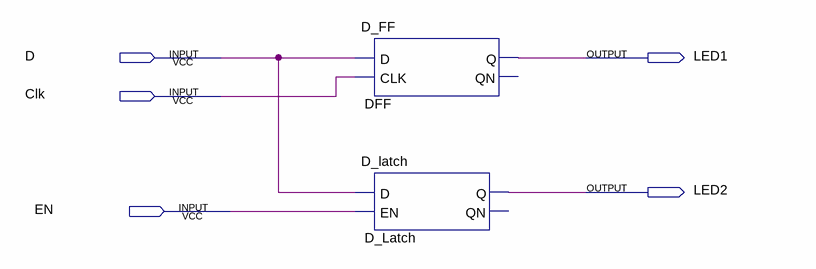
[diagram p0: schematic sheet]
// Quartus schematic D.bdf as structural Verilog: 2 symbols, 5 pins
module D (
  input  D,
  input  Clk,
  input  EN,
  output LED1,
  output LED2
);

  D_FF DFF (.D(D), .CLK(Clk), .Q(LED1));  // open: QN
  D_latch D_Latch (.D(D), .EN(EN), .Q(LED2));  // open: QN
endmodule
